# EAGLE design funkshield_v1 (EAGLE 6.3)
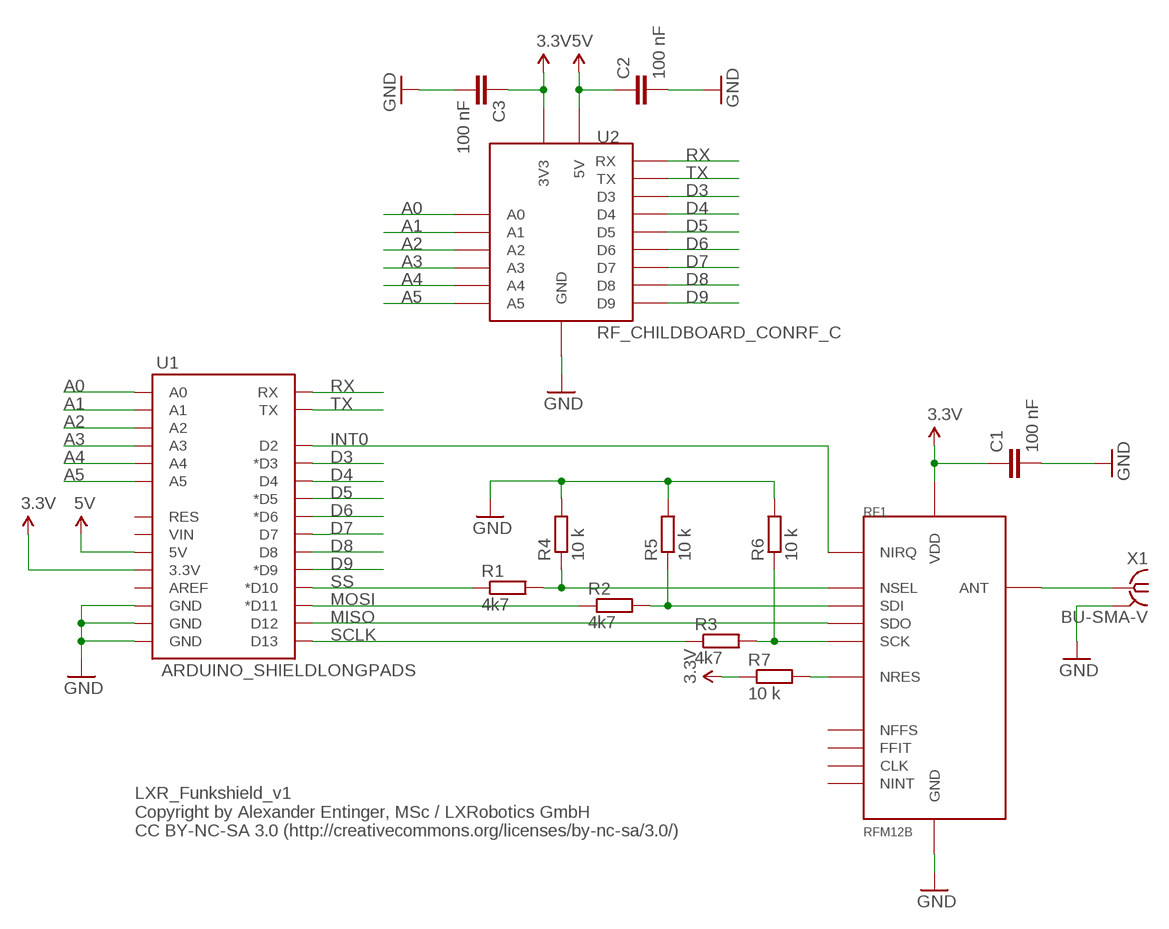
[diagram p0: schematic, sheet 1]

## Parts
C1  100 nF  C-EUC0805  [C0805]
C2  100 nF  C-EUC0805  [C0805]
C3  100 nF  C-EUC0805  [C0805]
R1  4k7  R-EU_M0805  [M0805]
R2  4k7  R-EU_M0805  [M0805]
R3  4k7  R-EU_M0805  [M0805]
R4  10 k  R-EU_M0805  [M0805]
R5  10 k  R-EU_M0805  [M0805]
R6  10 k  R-EU_M0805  [M0805]
R7  10 k  R-EU_M0805  [M0805]
RF1  RFM12B  [RFM12B]
U1  ARDUINO_SHIELDLONGPADS  [DUEMILANOVE_SHIELD_LONGPADS]
U2  RF_CHILDBOARD_CONRF_C  [RF_CHILDBOARD_CON]
X1  BU-SMA-V  [BU-SMA-V]

## Nets
3.3V: C1.1 C3.1 R7.1 RF1.VDD U1.3.3V U2.3V3
5V: C2.1 U1.5V U2.5V
A0: U1.A0 U2.A0
A1: U1.A1 U2.A1
A2: U1.A2 U2.A2
A3: U1.A3 U2.A3
A4: U1.A4 U2.A4
A5: U1.A5 U2.A5
D3: U1.D3(*D3) U2.D3
D4: U1.D4 U2.D4
D5: U1.D5(*D5) U2.D5
D6: U1.D6(*D6) U2.D6
D7: U1.D7 U2.D7
D8: U1.D8 U2.D8
D9: U1.D9(*D9) U2.D9
GND: C1.2 C2.2 C3.2 R4.2 R5.2 R6.2 RF1.GND RF1.GND1(GND) U1.GND@0(GND) U1.GND@1(GND) U1.GND@2(GND) U2.GND U2.GND1(GND) U2.GND2(GND) X1.2(GND)
INT0: RF1.NIRQ U1.D2
MISO: RF1.SDO U1.D12
MOSI: R2.1 U1.D11(*D11)
N$1: R1.2 R4.1 RF1.NSEL
N$2: R2.2 R5.1 RF1.SDI
N$3: R3.2 R6.1 RF1.SCK
N$4: R7.2 RF1.NRES
N$5: RF1.ANT X1.1
RX: U1.RX U2.RX
SCLK: R3.1 U1.D13
SS: R1.1 U1.D10(*D10)
TX: U1.TX U2.TX
Unconnected: RF1.CLK RF1.FFIT RF1.NFFS RF1.NINT U1.AREF U1.RES U1.VIN

## Notes on the sheet
- LXR_Funkshield_v1
  Copyright by Alexander Entinger, MSc / LXRobotics GmbH
  CC BY-NC-SA 3.0 (http://creativecommons.org/licenses/by-nc-sa/3.0/)

## Power pins joined to a net without a drawn wire
GND: X1.3(GND) X1.4(GND) X1.5(GND)

## Library data of the parts
C1-C3 = resistor:C-EU: CAPACITOR, European symbol
R1-R7 = resistor:R-EU_: RESISTOR, European symbol
RF1 = lxrobotics:RFM12B
U1 = SparkFun-Boards:ARDUINO_SHIELD: Arduino shield footprint
U2 = lxrobotics:RF_CHILDBOARD_CON
X1 = con-coax:BU-SMA-V: FEMALE SMA CONNECTOR Radiall distributor RS 112-3794; OC_FARNELL: unknown; OC_NEWARK: unknown

## Board
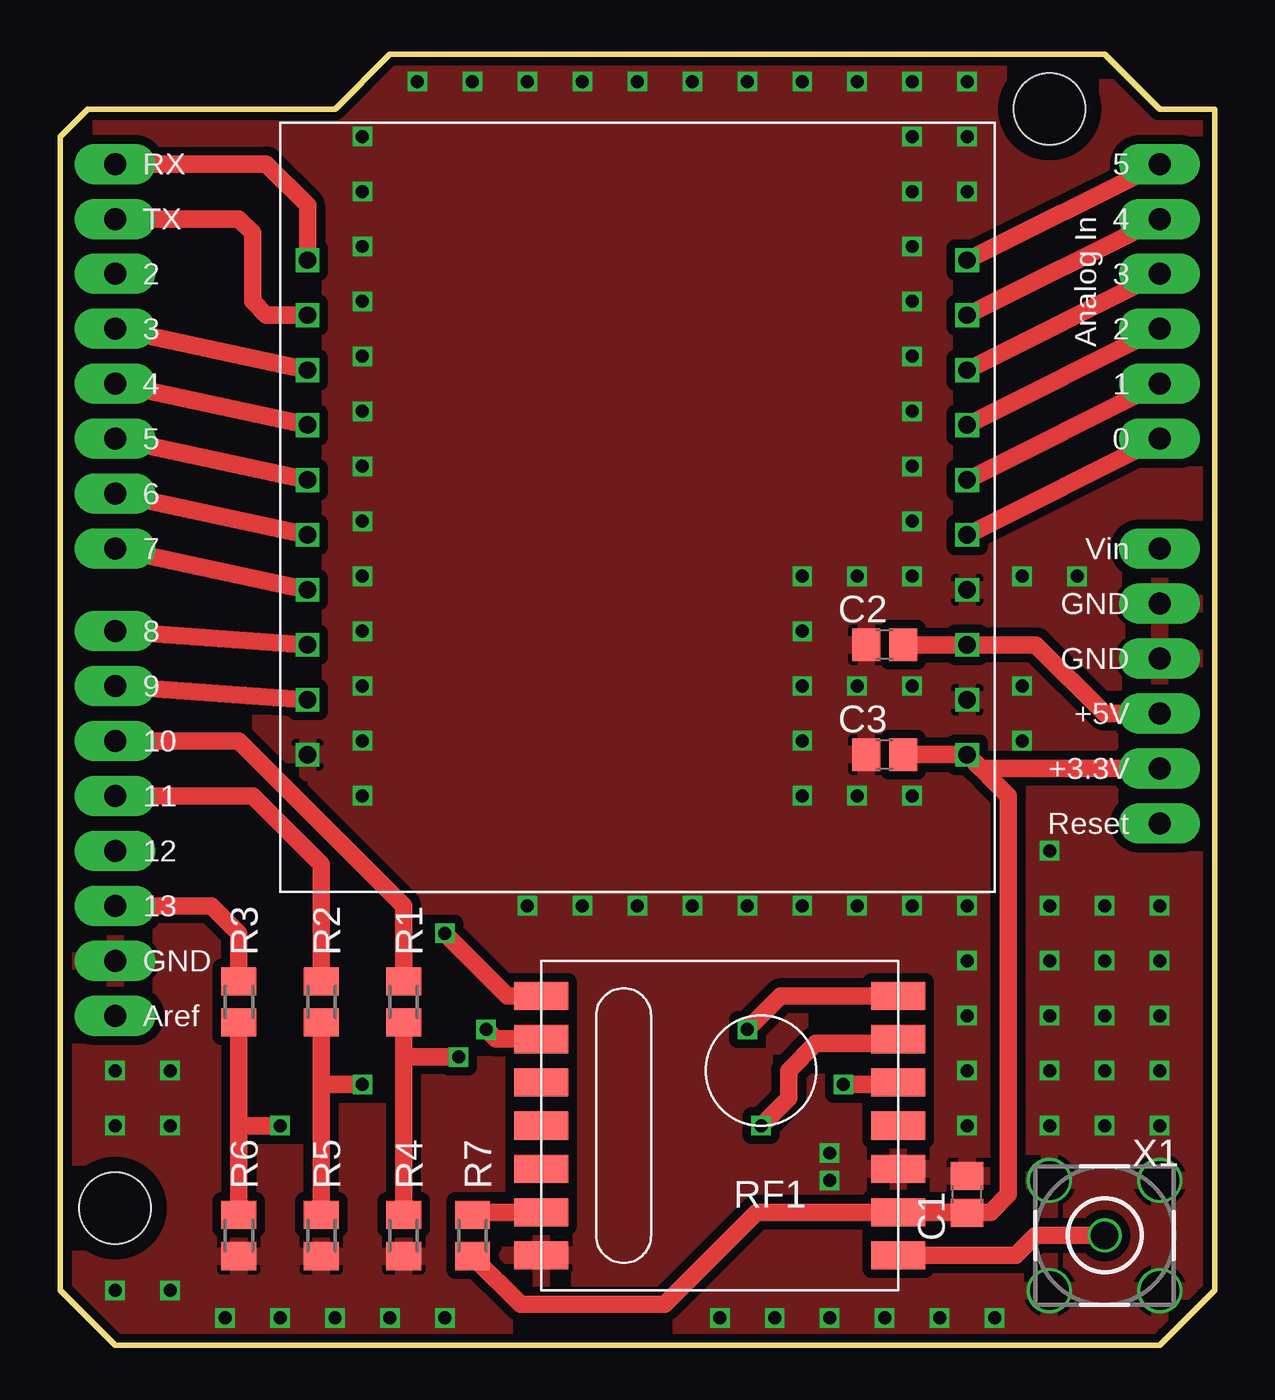
[diagram p1: board, top side]
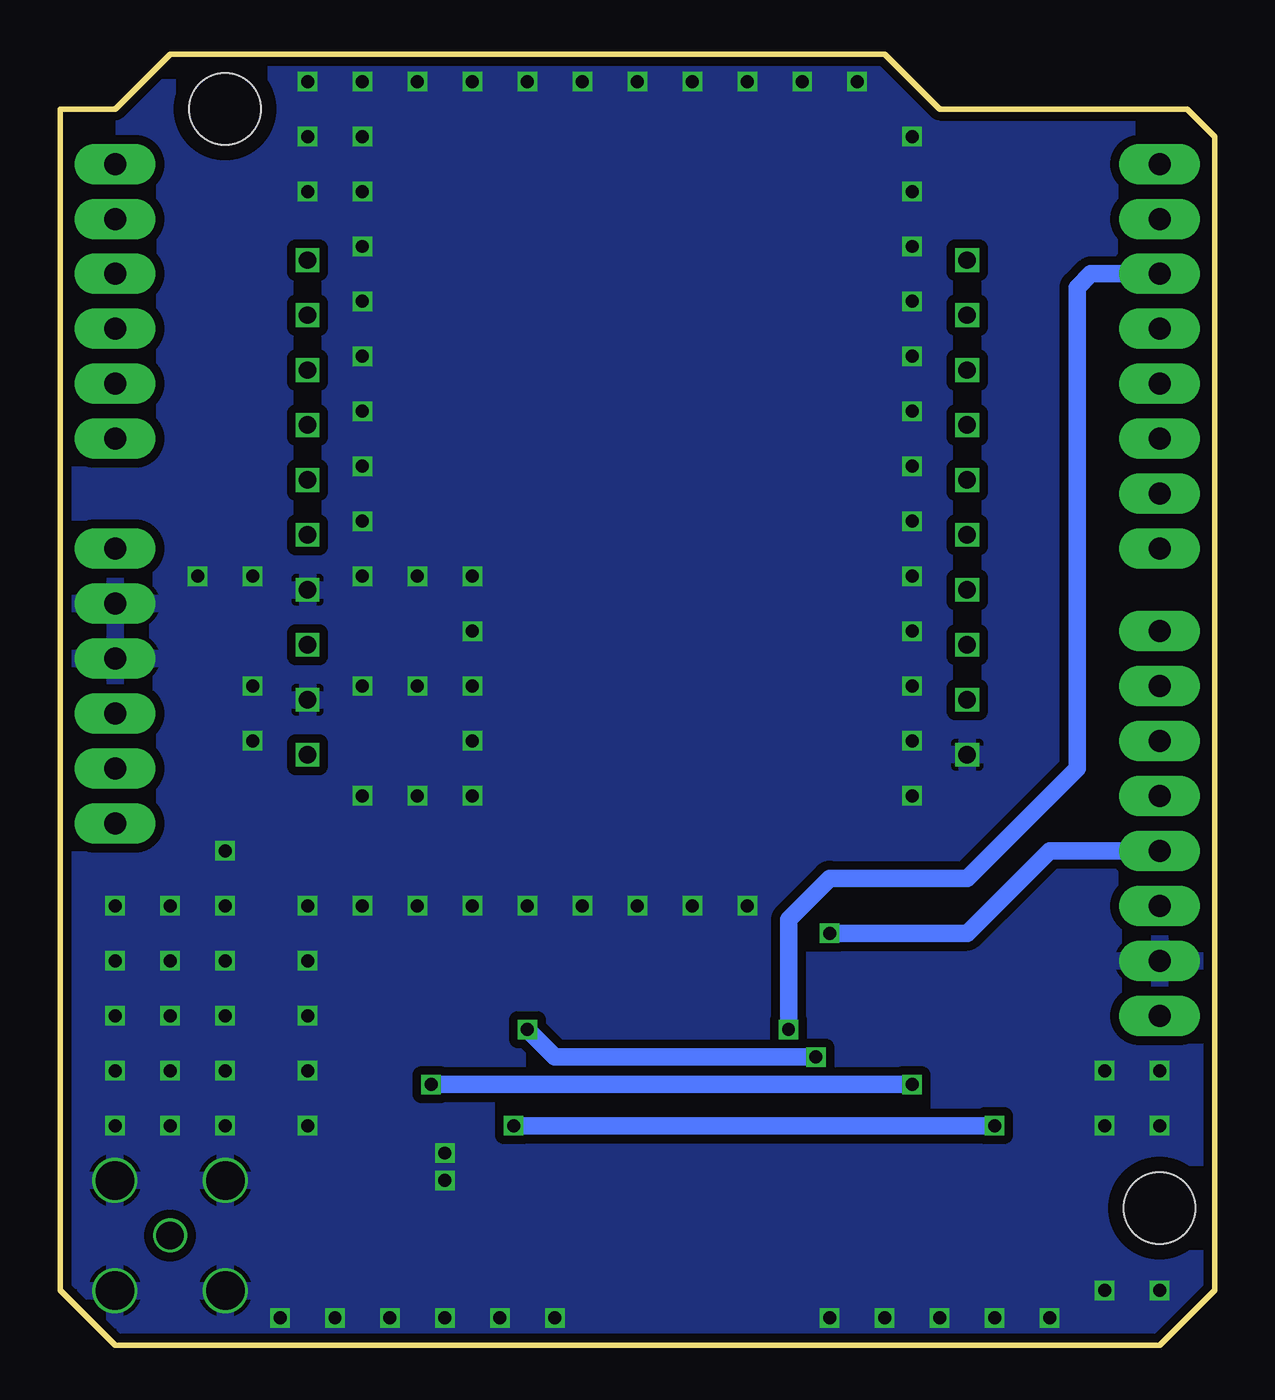
[diagram p2: board, bottom side, seen from below]

Size 53.34 x 59.69 mm. Coordinates in mm from the lower left corner, seen from the top.
Outline: 0,2.54 2.54,0 50.8,0 53.34,2.54 53.34,57.15 50.8,57.15 48.26,59.69 15.24,59.69 12.7,57.15 1.27,57.15 0,55.88 0,2.54
Copper layers (1*16): Top 0.035mm / dielectric 1.5mm / Bottom 0.035mm
Design rules "LeitOn - Standard-Eagle-DRU - 1- und  2-Lagen DK - deutsch - Rev 2.0": minimum track width 0.15mm, minimum drill 0.3mm, track to track 0.15mm, track to pad 0.15mm, pad to pad 0.15mm, via to via 0.15mm, smd to smd 0.15mm, copper to edge 0.3mm, drill to drill 0.3mm, minimum pad ring 0.15mm, minimum via ring 0.15mm, stop-mask expansion 0.075mm, vias tented up to drill 0mil, thermal gap 0.2mm

### Footprints (pad centres in the part's own frame; a part is rotated, then mirrored left to right if it is on the bottom)
C0805 = smd 1.3 x 1.5: 1 -0.85,0; 2 0.85,0
M0805 = smd 1.3 x 1.6: 1 -0.95,0; 2 0.95,0
RFM12B = smd 1.3 x 2.5: ANT 6,16.5; CLK 2,0; FFIT 0,0; GND 6,0; GND1 2,16.5; NFFS -2,0; NINT 0,16.5; NIRQ -4,0; NRES 4,0; NSEL -6,16.5; SCK -4,16.5; SDI -2,16.5; SDO -6,0; VDD 4,16.5
DUEMILANOVE_SHIELD_LONGPADS = drill 1.016 pad 1.88 long: 3.3V 50.8,26.67; 5V 50.8,29.21; A0 50.8,41.91; A1 50.8,44.45; A2 50.8,46.99; A3 50.8,49.53; A4 50.8,52.07; A5 50.8,54.61; AREF 2.54,15.24; D2 2.54,49.53; D3 2.54,46.99; D4 2.54,44.45; D5 2.54,41.91; D6 2.54,39.37; D7 2.54,36.83; D8 2.54,33.02; D9 2.54,30.48; D10 2.54,27.94; D11 2.54,25.4; D12 2.54,22.86; D13 2.54,20.32; GND@0 50.8,31.75; GND@1 50.8,34.29; GND@2 2.54,17.78; RES 50.8,24.13; RX 2.54,54.61; TX 2.54,52.07; VIN 50.8,36.83 | hole 3.302: 45.72,57.15; 2.54,6.35
RF_CHILDBOARD_CON = drill 0.8 square: 3V3 12.7,30.48; 5V 7.62,30.48; A0 2.54,30.48; A1 0,30.48; A2 -2.54,30.48; A3 -5.08,30.48; A4 -7.62,30.48; A5 -10.16,30.48; D3 -5.08,0; D4 -2.54,0; D5 0,0; D6 2.54,0; D7 5.08,0; D8 7.62,0; D9 10.16,0; GND 5.08,30.48; GND1 10.16,30.48; GND2 12.7,0; RX -10.16,0; TX -7.62,0
BU-SMA-V = drill 1.27: 1 0,0 | drill 1.778: 2 -2.55,2.55; 3 2.55,2.55; 4 2.55,-2.55; 5 -2.55,-2.55

### Placement (x,y rotation side)
C1  41.91,6.98 90 top
C2  38.1,32.38 180 top
C3  38.1,27.3 180 top
R1  15.88,15.88 270 top
R2  12.06,15.88 270 top
R3  8.25,15.88 270 top
R4  15.88,5.08 270 top
R5  12.06,5.08 270 top
R6  8.25,5.08 270 top
R7  19.05,5.08 90 top
RF1  22.23,10.16 270 top
U1  0,0 0 top
U2  11.43,40.01 270 top
X1  48.26,5.08 0 top

### Tracks (layer width: path | path; a pad name or v marks a point on that pad's centre or on a via)
3.3V
  Top 0.813: C1.1 41.89,6.16 | 41.89,6.16 RF1.VDD 32.2,6.16 27.94,1.91 21.27,1.91 R7.1 | U1.3.3V 42.55,26.67 U2.3V3 | C3.1 U2.3V3 | 41.89,6.16 42.99,6.16 43.81,6.98 43.81,25.4 U2.3V3
5V
  Top 0.813: U1.5V 48.26,29.21 45.08,32.38 U2.5V C2.1
A0
  Top 0.813: U2.A0 U1.A0
A1
  Top 0.813: U1.A1 U2.A1
A2
  Top 0.813: U1.A2 U2.A2
A3
  Top 0.813: U1.A3 U2.A3
A4
  Top 0.813: U2.A4 U1.A4
A5
  Top 0.813: U2.A5 U1.A5
D3
  Top 0.813: U1.D3 U2.D3
D4
  Top 0.813: U1.D4 U2.D4
D5
  Top 0.813: U1.D5 U2.D5
D6
  Top 0.813: U1.D6 U2.D6
D7
  Top 0.813: U1.D7 U2.D7
D8
  Top 0.813: U1.D8 U2.D8
D9
  Top 0.813: U1.D9 U2.D9
GND  (via drill 0.6)
  other vias: 2.54,12.7 5.08,12.7 5.08,10.16 2.54,10.16 2.54,2.54 5.08,2.54 7.62,1.27 10.16,1.27 12.7,1.27 15.24,1.27 17.78,1.27 30.48,1.27 33.02,1.27 35.56,1.27 38.1,1.27 40.64,1.27 43.18,1.27 21.59,20.32 24.13,20.32 26.67,20.32 29.21,20.32 31.75,20.32 34.29,20.32 36.83,20.32 39.37,20.32 41.91,20.32 41.91,17.78 41.91,15.24 41.91,12.7 41.91,10.16 45.72,10.16 48.26,10.16 50.8,10.16 50.8,12.7 48.26,12.7 45.72,12.7 45.72,17.78 48.26,17.78 50.8,17.78 50.8,20.32 48.26,20.32 45.72,20.32 45.72,22.86 39.37,35.56 36.83,35.56 34.29,35.56 34.29,33.02 34.29,30.48 36.83,30.48 39.37,30.48 34.29,27.94 34.29,25.4 36.83,25.4 39.37,25.4 46.99,35.56 44.45,35.56 44.45,30.48 44.45,27.94 13.97,53.34 13.97,50.8 13.97,48.26 13.97,45.72 13.97,43.18 13.97,40.64 13.97,38.1 13.97,35.56 13.97,33.02 13.97,30.48 13.97,27.94 13.97,25.4 39.37,38.1 39.37,40.64 39.37,43.18 39.37,45.72 39.37,48.26 39.37,50.8 39.37,53.34 41.91,53.34 45.72,15.24 48.26,15.24 50.8,15.24 13.97,55.88 16.51,58.42 19.05,58.42 21.59,58.42 24.13,58.42 26.67,58.42 29.21,58.42 31.75,58.42 34.29,58.42 36.83,58.42 39.37,55.88 41.91,55.88 41.91,58.42 39.37,58.42 35.56,8.89 35.56,7.62
  pour Top (isolate 0.406): 0.64,2.54 2.54,0.63 50.8,0.63 52.7,2.54 52.7,56.51 50.8,56.51 50.17,56.51 47.62,59.05 15.88,59.05 13.34,56.51 1.91,56.51 0.64,55.24
  pour Bottom (isolate 0.406): 0.64,2.54 2.54,0.63 50.17,0.63 52.7,3.18 52.7,56.51 50.17,56.51 47.62,59.05 15.88,59.05 13.34,56.51 1.91,56.51 0.64,55.24
INT0  (via drill 0.6)
  Top 0.813: RF1.NIRQ 20.13,14.16 v19.69,14.61
  Bottom 0.813: v19.69,14.61 19.69,19.68 17.78,21.59 11.43,21.59 6.35,26.67 6.35,48.9 5.71,49.53 U1.D2
MISO  (via drill 0.6)
  Top 0.813: RF1.SDO 20.67,16.16 v17.78,19.05
  Bottom 0.813: v17.78,19.05 11.43,19.05 7.62,22.86 U1.D12
MOSI
  Top 0.813: U1.D11 8.89,25.4 12.06,22.23 R2.1
N$1  (via drill 0.6)
  Top 0.813: R4.1 15.88,13.34 | 15.88,13.34 R1.2 | RF1.NSEL 33.3,16.16 v31.75,14.61 | v18.41,13.34 15.88,13.34
  Bottom 0.813: v31.75,14.61 30.48,13.34 v18.41,13.34
N$2  (via drill 0.6)
  Top 0.813: R5.1 12.06,12.07 | 12.06,12.07 R2.2 | RF1.SDI 38.63,12.07 v36.2,12.07 | v13.97,12.07 12.06,12.07
  Bottom 0.813: v36.2,12.07 v13.97,12.07
N$3  (via drill 0.6)
  Top 0.813: R3.2 8.25,10.16 | 8.25,10.16 R6.1 | RF1.SCK 38.54,13.97 34.92,13.97 33.66,12.7 33.66,11.43 v32.38,10.16 | v10.16,10.16 8.25,10.16
  Bottom 0.813: v32.38,10.16 v10.16,10.16
N$4
  Top 0.813: R7.2 19.18,6.16 RF1.NRES
N$5
  Top 0.813: RF1.ANT 44.17,4.16 45.08,5.08 X1.1
RX
  Top 0.813: U1.RX 9.52,54.61 11.43,52.71 U2.RX
SCLK
  Top 0.813: R3.1 8.25,19.05 6.98,20.32 U1.D13
SS
  Top 0.813: R1.1 15.88,20.32 8.25,27.94 U1.D10
TX
  Top 0.813: U1.TX 8.25,52.07 8.89,51.44 8.89,48.26 9.52,47.62 U2.TX